# Altium schematic sheet Sch_stm32f103c8.SchDoc
size A
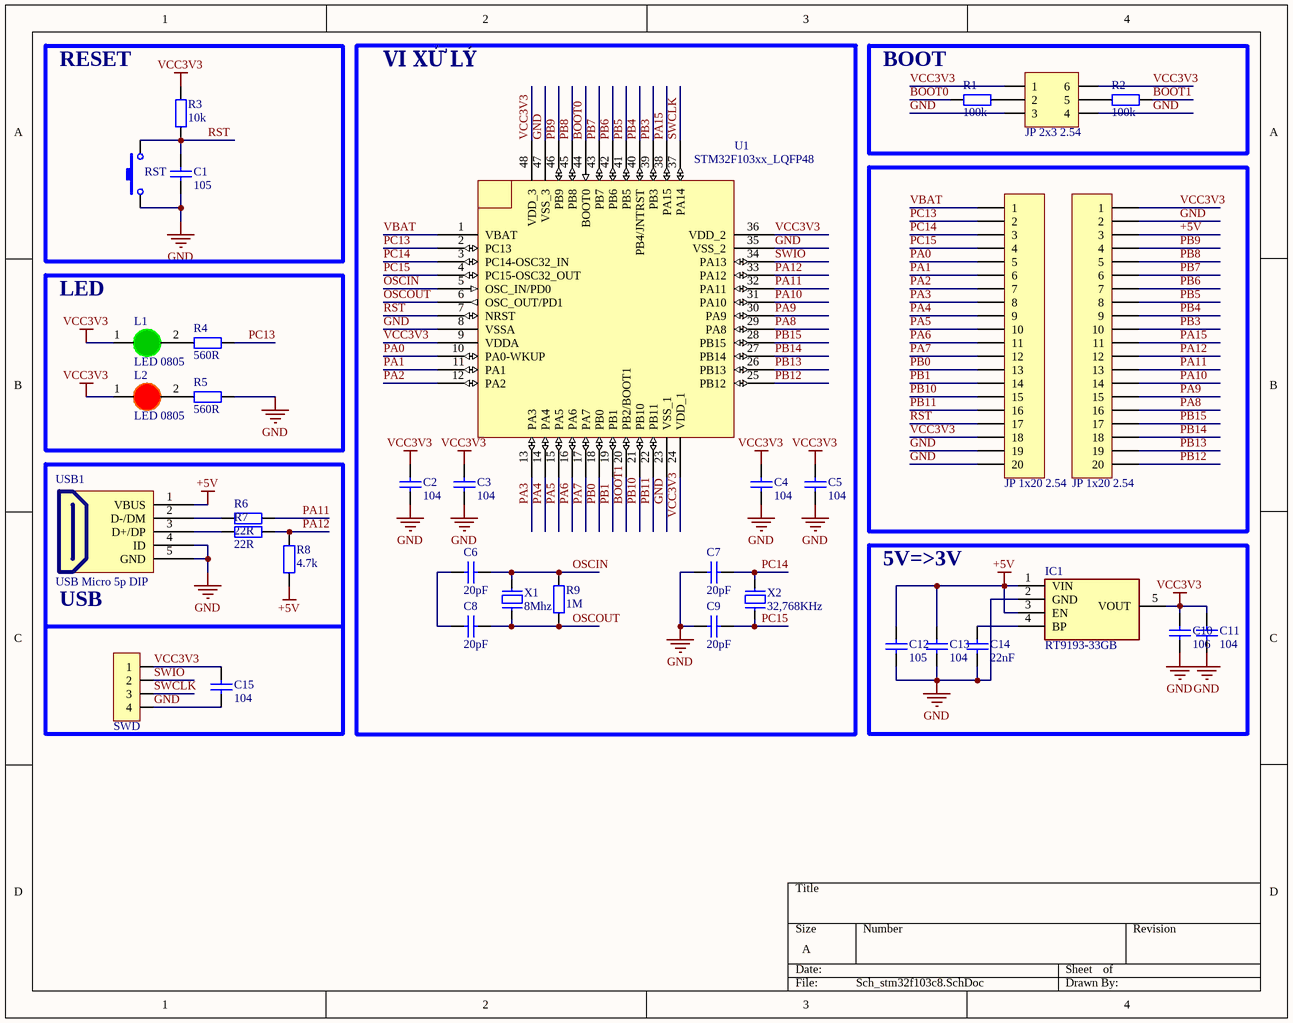
[diagram p0: Sch_stm32f103c8.SchDoc]

## Parts
C1  105  [tu 0805]
C2  104  [tu 0805]
C3  104  [tu 0805]
C4  104  [tu 0805]
C5  104  [tu 0805]
C6  20pF  [tu 0805]
C7  20pF  [tu 0805]
C8  20pF  [tu 0805]
C9  20pF  [tu 0805]
C10  106  [tu 0805]
C11  104  [tu 0805]
C12  105  [tu 0805]
C13  104  [tu 0805]
C14  22nF  [tu 0805]
C15  104  [tu 0805]
IC1  RT9193-33GB  [SOT94P279X130-5N]
JP1  JP 2x3 2.54  [JP 2x3 DT]
JP2  JP 1x20 2.54  [JP 1x20 DT]
JP3  JP 1x20 2.54  [JP 1x20 DT]
JP4  SWD  [JP 1x4 DT]
L1  LED 0805  [LED-0805-Green]
L2  LED 0805  [LED-0805-Red]
R1  100k  [tro smd 0805]
R2  100k  [tro smd 0805]
R3  10k  [tro smd 0805]
R4  560R  [tro smd 0805]
R5  560R  [tro smd 0805]
R6  22R  [tro smd 0805]
R7  22R  [tro smd 0805]
R8  4.7k  [tro smd 0805]
R9  1M  [tro smd 0603]
RST  Nut Nhan 2 Chan SMD 3x6x2.5  [Nut Nhan 2 Chan SMD 3x6x2.5]  (value not drawn)
U1  STM32F103xx_LQFP48  [STM32_LQPF48]
USB1  USB Micro 5p DIP  [USB Micro 5p DIP]
X1  8Mhz  [XT2]
X2  32,768KHz  [XT2-32.768KHz-2_V]

## Blocks framed on the sheet
RESET: C1 R3 RST
VI XỬ LÝ: C2-C9 R9 U1 X1 X2
BOOT: JP1 R1 R2
LED: L1 L2 R4 R5
USB: C15 JP4 R6-R8 USB1
5V=>3V: C10-C14 IC1

## Nets
+5V: C12.1 C13.1 IC1.1(VIN) IC1.3(EN) JP3.3 R8.1 USB1.1(VBUS)
GND: C1.2 C2.2 C3.2 C4.2 C5.2 C7.2 C9.2 C10.2 C11.2 C12.2 C13.2 C14.2 C15.2 IC1.2(GND) JP1.3 JP1.4 JP2.19 JP2.20 JP3.2 JP4.4 R5.2 RST.1 U1.8(VSSA) U1.23(VSS_1) U1.35(VSS_2) U1.47(VSS_3) USB1.4(ID) USB1.5(GND)
VCC3V3: C2.1 C3.1 C4.1 C5.1 C10.1 C11.1 C15.1 IC1.5(VOUT) JP1.1 JP1.6 JP2.18 JP3.1 JP4.1 L1.1(A) L2.1(A) R3.2 U1.9(VDDA) U1.24(VDD_1) U1.36(VDD_2) U1.48(VDD_3)
BOOT0: R1.1 U1.44(BOOT0)
BOOT1: R2.2 U1.20(PB2/BOOT1)
OSCIN: C6.1 R9.2 U1.5(OSC_IN/PD0) X1.2
OSCOUT: C8.1 R9.1 U1.6(OSC_OUT/PD1) X1.1
PA0: JP2.5 U1.10(PA0-WKUP)
PA1: JP2.6 U1.11(PA1)
PA2: JP2.7 U1.12(PA2)
PA3: JP2.8 U1.13(PA3)
PA4: JP2.9 U1.14(PA4)
PA5: JP2.10 U1.15(PA5)
PA6: JP2.11 U1.16(PA6)
PA7: JP2.12 U1.17(PA7)
PA8: JP3.16 U1.29(PA8)
PA9: JP3.15 U1.30(PA9)
PA10: JP3.14 U1.31(PA10)
PA11: JP3.13 R6.2 U1.32(PA11)
PA12: JP3.12 R7.2 R8.2 U1.33(PA12)
PA15: JP3.11 U1.38(PA15)
PB0: JP2.13 U1.18(PB0)
PB1: JP2.14 U1.19(PB1)
PB3: JP3.10 U1.39(PB3)
PB4: JP3.9 U1.40(PB4/JNTRST)
PB5: JP3.8 U1.41(PB5)
PB6: JP3.7 U1.42(PB6)
PB7: JP3.6 U1.43(PB7)
PB8: JP3.5 U1.45(PB8)
PB9: JP3.4 U1.46(PB9)
PB10: JP2.15 U1.21(PB10)
PB11: JP2.16 U1.22(PB11)
PB12: JP3.20 U1.25(PB12)
PB13: JP3.19 U1.26(PB13)
PB14: JP3.18 U1.27(PB14)
PB15: JP3.17 U1.28(PB15)
PC13: JP2.2 R4.2 U1.2(PC13)
PC14: C7.1 JP2.3 U1.3(PC14-OSC32_IN) X2.2
PC15: C9.1 JP2.4 U1.4(PC15-OSC32_OUT) X2.1
RST: C1.1 JP2.17 R3.1 RST.2 U1.7(NRST)
SWCLK: JP4.3 U1.37(PA14)
SWIO: JP4.2 U1.34(PA13)
VBAT: JP2.1 U1.1(VBAT)
NetC6_2: C6.2 C8.2
NetC14_1: C14.1 IC1.4(BP)
NetJP1_2: JP1.2 R1.2
NetJP1_5: JP1.5 R2.1
NetL1_2: L1.2(K) R4.1
NetL2_2: L2.2(K) R5.1
NetR6_1: R6.1 USB1.2(D-/DM)
NetR7_1: R7.1 USB1.3(D+/DP)

## Library data of the parts
C1 C12 = Tu 0805 105 50V 10%: Dán; Don_Vi: Con; So_Chan: 2; Ten_Linh_Kien: Tụ 0805 105-1uF 10% 50V; Ma_Hang: MH004552; Chung_Loai: Dán; Kieu_Chan: *
C2-C5 C11 C13 C15 = Tu 0805 104 50V 10%: Dán; Don_Vi: Con; So_Chan: 2; Ten_Linh_Kien: Tụ 0805 104-100nF 10% 50V; Ma_Hang: MH004551; Chung_Loai: Dán; Kieu_Chan: *
C6-C9 = Tu 0805 20pF 50V 10%: Dán; Don_Vi: Con; Ten_Linh_Kien: Tụ 0805 20P 10% 50V; So_Chan: 2; Ma_Hang: MH004558; Chung_Loai: Dán; Kieu_Chan: *
C10 = Tu 0805 106 16V 10%: Dán; Ten_Linh_Kien: Tụ 0805 106-10uF 10% 16V; So_Chan: 2; Don_Vi: Con; Ma_Hang: MH004553; Chung_Loai: Dán; Kieu_Chan: *
C14 = Tu 0805 22nF 50V 20%: Dán; Don_Vi: Con; So_Chan: 2; Ten_Linh_Kien: Tụ 0805 22nF 50V 20%; Ma_Hang: MH007857; Chung_Loai: Dán; Kieu_Chan: *
IC1 = RT9193-33GB: Integrated Circuit; Manufacturer_Name: RICHTEK; Datasheet Link: http://www.richtek.com/assets/product_file/RT9193/DS9193-17.pdf; Height: 1.295mm; Manufacturer_Part_Number: RT9193-33GB
JP1 = JP 2x3 2.54 Duc Thang: Cắm; Ten_Linh_Kien: Jump Đôi Đực 2.54MM 2x40P Thẳng 11MM; Don_Vi: Con; Ma_Hang: MH002686; Ghi_Chu: *; Kieu_Chan: *; Chung_Loai: Cắm
JP2 JP3 = JP 1x20 2.54 Duc Thang: Cắm; Ten_Linh_Kien: Jump Đơn Đực 2.54MM 1x40P Thẳng 11MM; Don_Vi: Con; Ma_Hang: MH000903; Ghi_Chu: *; Kieu_Chan: *; Chung_Loai: Cắm
JP4 = JP 1x4 2.54 Duc Thang: Cắm; Ten_Linh_Kien: Jump Đơn Đực 2.54MM 1x40P Thẳng 11MM; Don_Vi: Con; Ma_Hang: MH000903; Ghi_Chu: *; Kieu_Chan: *; Chung_Loai: Cắm
L1 = LED 0805 Xanh La: Dán; Don_Vi: Con; Ma_Hang: MH002326; Ten_Linh_Kien: LED 0805 Màu Xanh Lá (Green); Ghi_Chu: *; Kieu_Chan: *; Chung_Loai: Dán
L2 = LED 0805 Do: Dán; Don_Vi: Con; Ma_Hang: MH000897; Ten_Linh_Kien: LED 0805 Màu Đỏ (Red); Ghi_Chu: *; Kieu_Chan: *; Chung_Loai: Dán
R1 R2 = Tro 0805 5% 100k: Dán; Don_Vi: Con; So_Chan: 2; Ten_Linh_Kien: Trở 0805 5% 100k; Ma_Hang: MH005250; Chung_Loai: Dán; Kieu_Chan: *
R3 = Tro 0805 5% 10k: Dán; Don_Vi: Con; So_Chan: 2; Ten_Linh_Kien: Trở 0805 5% 10k; Ma_Hang: MH005239; Chung_Loai: Dán; Kieu_Chan: *
R4 R5 = Tro 0805 5% 560R: Dán; Don_Vi: Con; So_Chan: 2; Ten_Linh_Kien: Trở 0805 5% 560R; Ma_Hang: MH005261; Chung_Loai: Dán; Kieu_Chan: *
R6 R7 = Tro 0805 5% 22R: Dán; Don_Vi: Con; So_Chan: 2; Ten_Linh_Kien: Trở 0805 5% 22R; Ma_Hang: MH005249; Chung_Loai: Dán; Kieu_Chan: *
R8 = Tro 0805 5% 4.7k: Dán; Don_Vi: Con; So_Chan: 2; Ten_Linh_Kien: Trở 0805 5% 4.7k; Ma_Hang: MH005307; Chung_Loai: Dán; Kieu_Chan: *
R9 = Tro 0603 5% 1M: Dán; Don_Vi: Con; So_Chan: 2; Ten_Linh_Kien: Trở 0603 5% 1M; Ma_Hang: MH006909; Chung_Loai: Dán; Kieu_Chan: *
RST = Nut Nhan 2 Chan SMD 3x6x2.5: Ma_Hang: MH001036; Ten: Nút Nhấn 2 Chân 3x6x2.5MM SMD
USB1 = USB Micro 5p DIP: USB Type B; Ten: MicroUSB MK5P DIP; Ma_Hang: MH005145
X1 X2 = XT2: Crystal, 32.768 KHz, -40 to 85 degC, 3.2 x 1.5 x 0.9 mm SMD; Value: 4Mhz
U1 = STM32F103xx_LQFP48: Published: 30-May-2008; DatasheetVersion: rev6, Mar-2008; PackageVersion: Mar-2008; PackageReference: LQFP48; Publisher: Altium Limited; PackageDescription: 48-Pin Low-Profile Quad Flat Pack, 7 x 7 mm Body, 0.5 mm Pitch (LQFP48); ComponentLink1Description: Manufacturer Link; ComponentLink1URL: www.st.com/stm32; ComponentLink2Description: Datasheet; ComponentLink2URL: http://www.st.com/stonline/products/literature/ds/13587.pdf